# Altium project pinus.PrjPCB
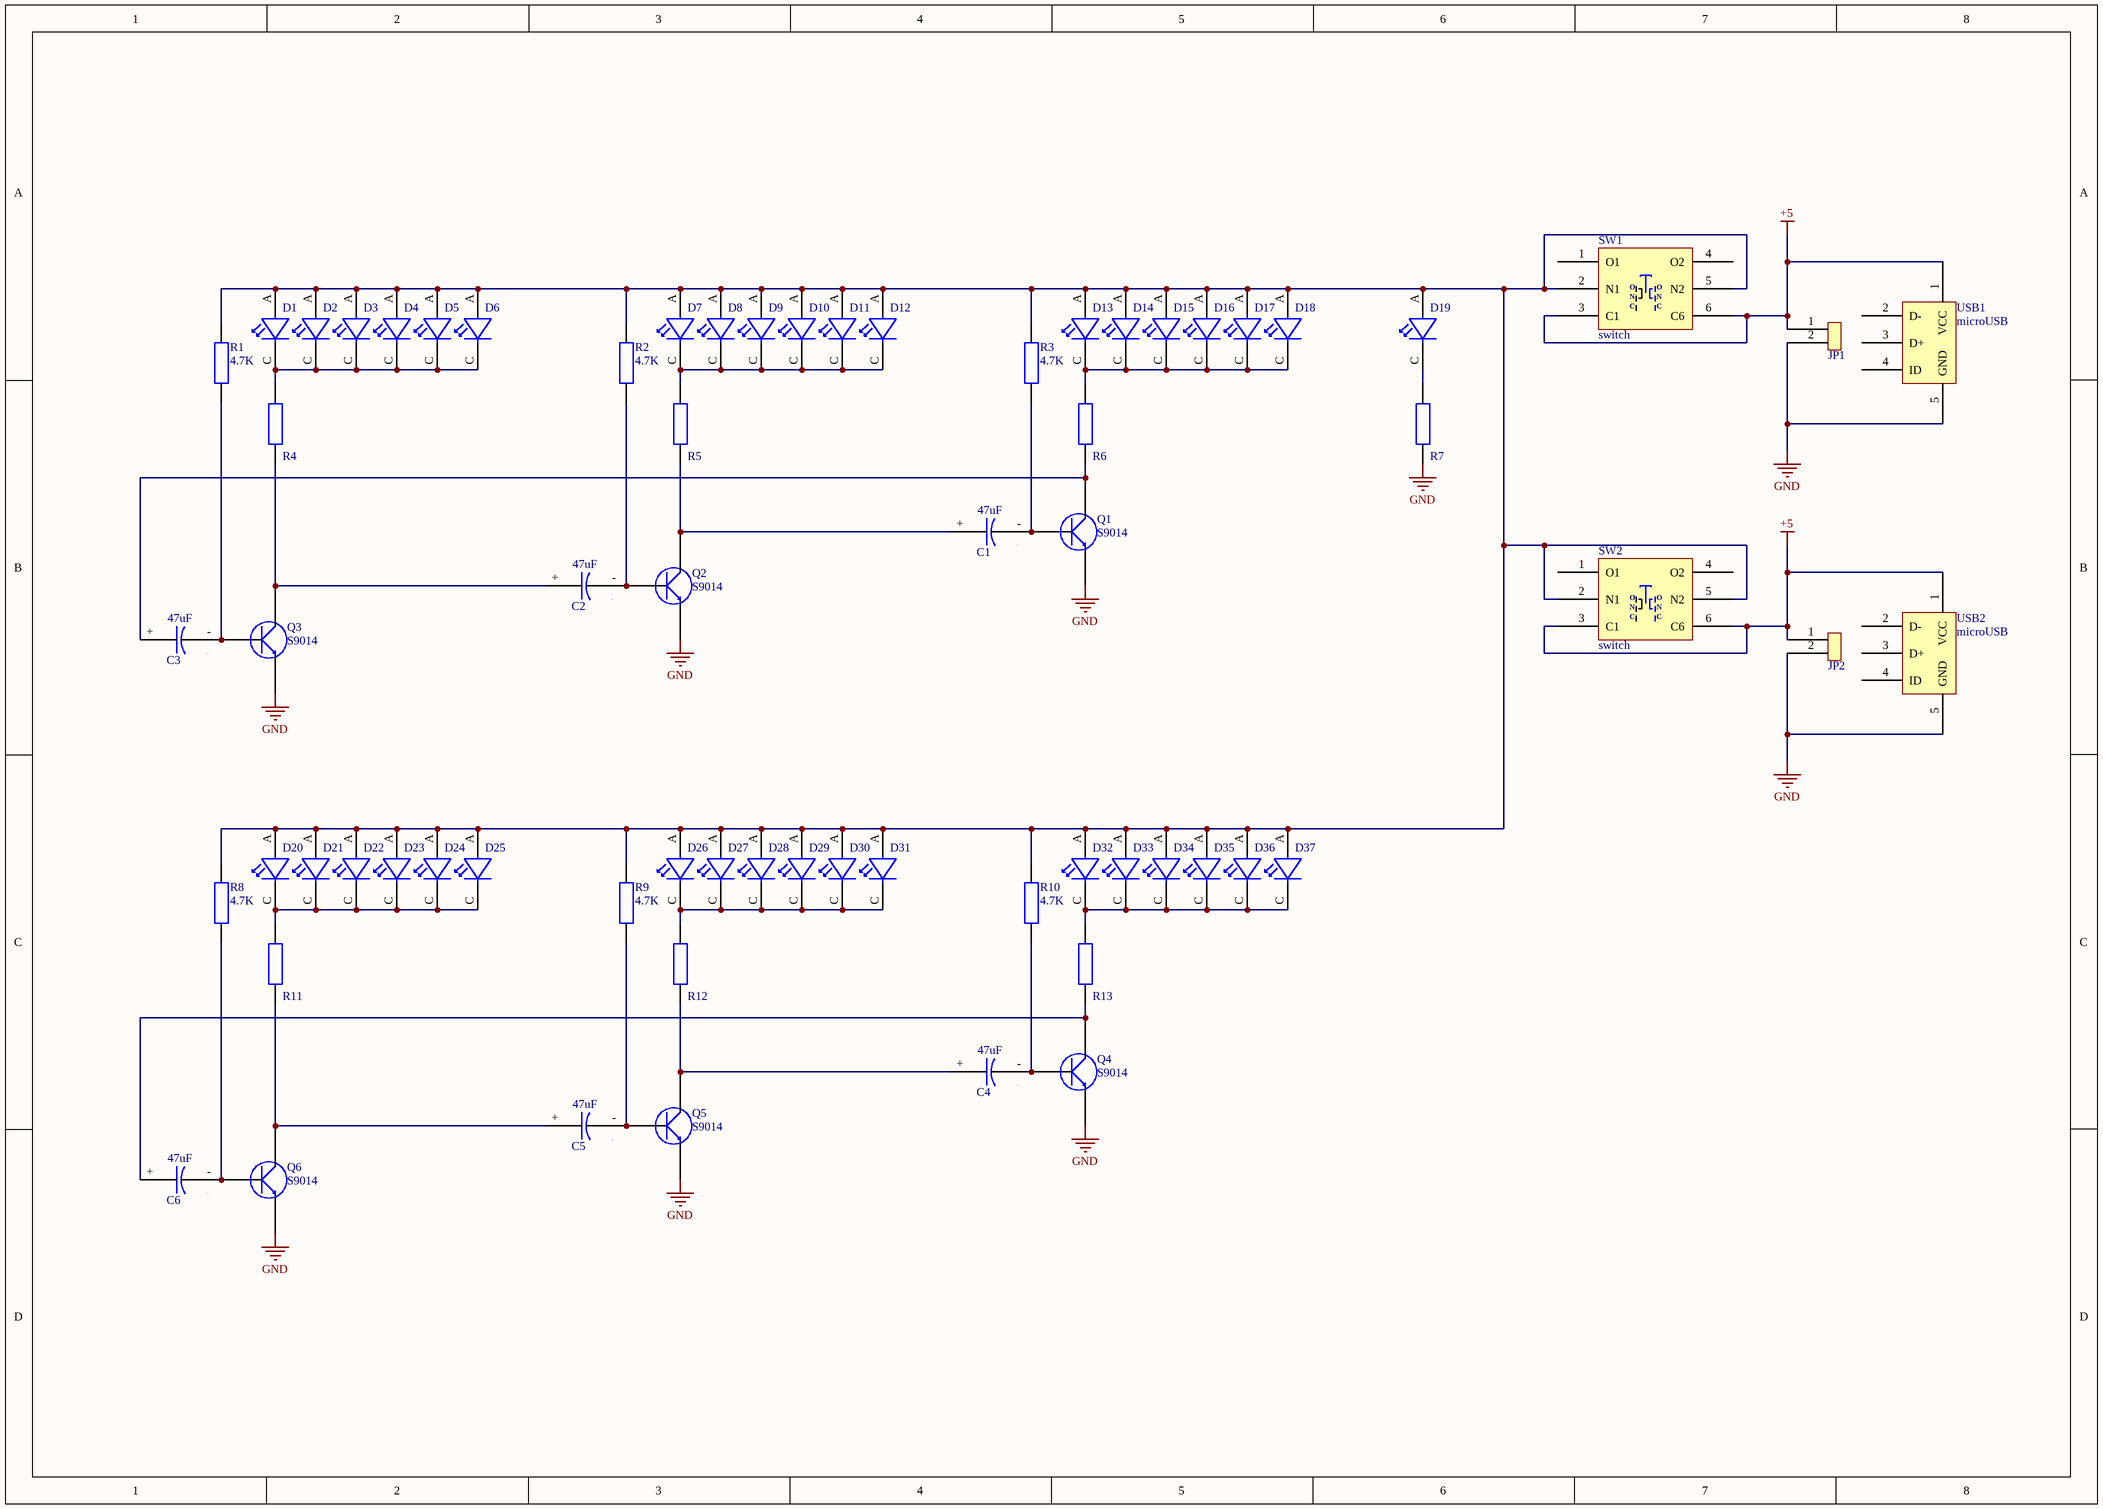
[diagram p0: pinus.SchDoc]
1 sheet, 68 parts. Net scope: global (net labels, ports and power ports of the same name join across sheets).
Board file: pinus.PcbDoc

## Sheet pinus.SchDoc
size A3

### Parts
C1  47uF  [POL_160mil_HORIZONTAL]
C2  47uF  [POL_160mil_HORIZONTAL]
C3  47uF  [POL_160mil_HORIZONTAL]
C4  47uF  [POL_160mil_HORIZONTAL]
C5  47uF  [POL_160mil_HORIZONTAL]
C6  47uF  [POL_160mil_HORIZONTAL]
D1  LED-200mil  [LED-200mil]  (value not drawn)
D2  LED-200mil  [LED-200mil]  (value not drawn)
D3  LED-200mil  [LED-200mil]  (value not drawn)
D4  LED-200mil  [LED-200mil]  (value not drawn)
D5  LED-200mil  [LED-200mil]  (value not drawn)
D6  LED-200mil  [LED-200mil]  (value not drawn)
D7  LED-200mil  [LED-200mil]  (value not drawn)
D8  LED-200mil  [LED-200mil]  (value not drawn)
D9  LED-200mil  [LED-200mil]  (value not drawn)
D10  LED-200mil  [LED-200mil]  (value not drawn)
D11  LED-200mil  [LED-200mil]  (value not drawn)
D12  LED-200mil  [LED-200mil]  (value not drawn)
D13  LED-200mil  [LED-200mil]  (value not drawn)
D14  LED-200mil  [LED-200mil]  (value not drawn)
D15  LED-200mil  [LED-200mil]  (value not drawn)
D16  LED-200mil  [LED-200mil]  (value not drawn)
D17  LED-200mil  [LED-200mil]  (value not drawn)
D18  LED-200mil  [LED-200mil]  (value not drawn)
D19  LED-200mil  [LED-200mil]  (value not drawn)
D20  LED-200mil  [LED-200mil]  (value not drawn)
D21  LED-200mil  [LED-200mil]  (value not drawn)
D22  LED-200mil  [LED-200mil]  (value not drawn)
D23  LED-200mil  [LED-200mil]  (value not drawn)
D24  LED-200mil  [LED-200mil]  (value not drawn)
D25  LED-200mil  [LED-200mil]  (value not drawn)
D26  LED-200mil  [LED-200mil]  (value not drawn)
D27  LED-200mil  [LED-200mil]  (value not drawn)
D28  LED-200mil  [LED-200mil]  (value not drawn)
D29  LED-200mil  [LED-200mil]  (value not drawn)
D30  LED-200mil  [LED-200mil]  (value not drawn)
D31  LED-200mil  [LED-200mil]  (value not drawn)
D32  LED-200mil  [LED-200mil]  (value not drawn)
D33  LED-200mil  [LED-200mil]  (value not drawn)
D34  LED-200mil  [LED-200mil]  (value not drawn)
D35  LED-200mil  [LED-200mil]  (value not drawn)
D36  LED-200mil  [LED-200mil]  (value not drawn)
D37  LED-200mil  [LED-200mil]  (value not drawn)
JP1  JP_2  [JP_2]  (value not drawn)
JP2  JP_2  [JP_2]  (value not drawn)
Q1  S9014  [S9014]
Q2  S9014  [S9014]
Q3  S9014  [S9014]
Q4  S9014  [S9014]
Q5  S9014  [S9014]
Q6  S9014  [S9014]
R1  4.7K  [RES]
R2  4.7K  [RES]
R3  4.7K  [RES]
R4  100R  [RES]  (value not drawn)
R5  100R  [RES]  (value not drawn)
R6  100R  [RES]  (value not drawn)
R7  100R  [RES]  (value not drawn)
R8  4.7K  [RES]
R9  4.7K  [RES]
R10  4.7K  [RES]
R11  100R  [RES]  (value not drawn)
R12  100R  [RES]  (value not drawn)
R13  100R  [RES]  (value not drawn)
SW1  switch  [switch]
SW2  switch  [switch]
USB1  microUSB  [MicroUSB_F_2]
USB2  microUSB  [MicroUSB_F_2]

### Nets
+5: JP1.1 JP2.1 SW1.3(C1) SW1.6(C6) SW2.3(C1) SW2.6(C6) USB1.1(VCC) USB2.1(VCC)
GND: JP1.2 JP2.2 Q1.1 Q2.1 Q3.1 Q4.1 Q5.1 Q6.1 R7.1 USB1.5(GND) USB2.5(GND)
NetC1_+: C1.+ Q2.3 R5.1
NetC1_-: C1.- Q1.2 R3.1
NetC2_+: C2.+ Q3.3 R4.1
NetC2_-: C2.- Q2.2 R2.1
NetC3_+: C3.+ Q1.3 R6.1
NetC3_-: C3.- Q3.2 R1.1
NetC4_+: C4.+ Q5.3 R12.1
NetC4_-: C4.- Q4.2 R10.1
NetC5_+: C5.+ Q6.3 R11.1
NetC5_-: C5.- Q5.2 R9.1
NetC6_+: C6.+ Q4.3 R13.1
NetC6_-: C6.- Q6.2 R8.1
NetD1_A: D1.A D2.A D3.A D4.A D5.A D6.A D7.A D8.A D9.A D10.A D11.A D12.A D13.A D14.A D15.A D16.A D17.A D18.A D19.A D20.A D21.A D22.A D23.A D24.A D25.A D26.A D27.A D28.A D29.A D30.A D31.A D32.A D33.A D34.A D35.A D36.A D37.A R1.2 R2.2 R3.2 R8.2 R9.2 R10.2 SW1.2(N1) SW1.5(N2) SW2.2(N1) SW2.5(N2)
NetD1_C: D1.C D2.C D3.C D4.C D5.C D6.C R4.2
NetD7_C: D7.C D8.C D9.C D10.C D11.C D12.C R5.2
NetD13_C: D13.C D14.C D15.C D16.C D17.C D18.C R6.2
NetD19_C: D19.C R7.2
NetD20_C: D20.C D21.C D22.C D23.C D24.C D25.C R11.2
NetD26_C: D26.C D27.C D28.C D29.C D30.C D31.C R12.2
NetD32_C: D32.C D33.C D34.C D35.C D36.C D37.C R13.2

Not connected (* = marked no-connect by the designer): SW1 1(O1) 4(O2); SW2 1(O1) 4(O2); USB1 2(D-) 3(D+) 4(ID); USB2 2(D-) 3(D+) 4(ID)

### Notes on the sheet
- (in symbol switch) O; N; C

### Library data of the parts
C1-C6 = Pol-Cap: Tụ điện phân cực
R1-R13 = RES: điện trở size nhỏ